# EAGLE design Adafruit LSM9DS0 PCB (EAGLE 6.3)
COMPANY: ADAFRUIT INDUSTRIES; DRAWN: KTOWN; REV: B
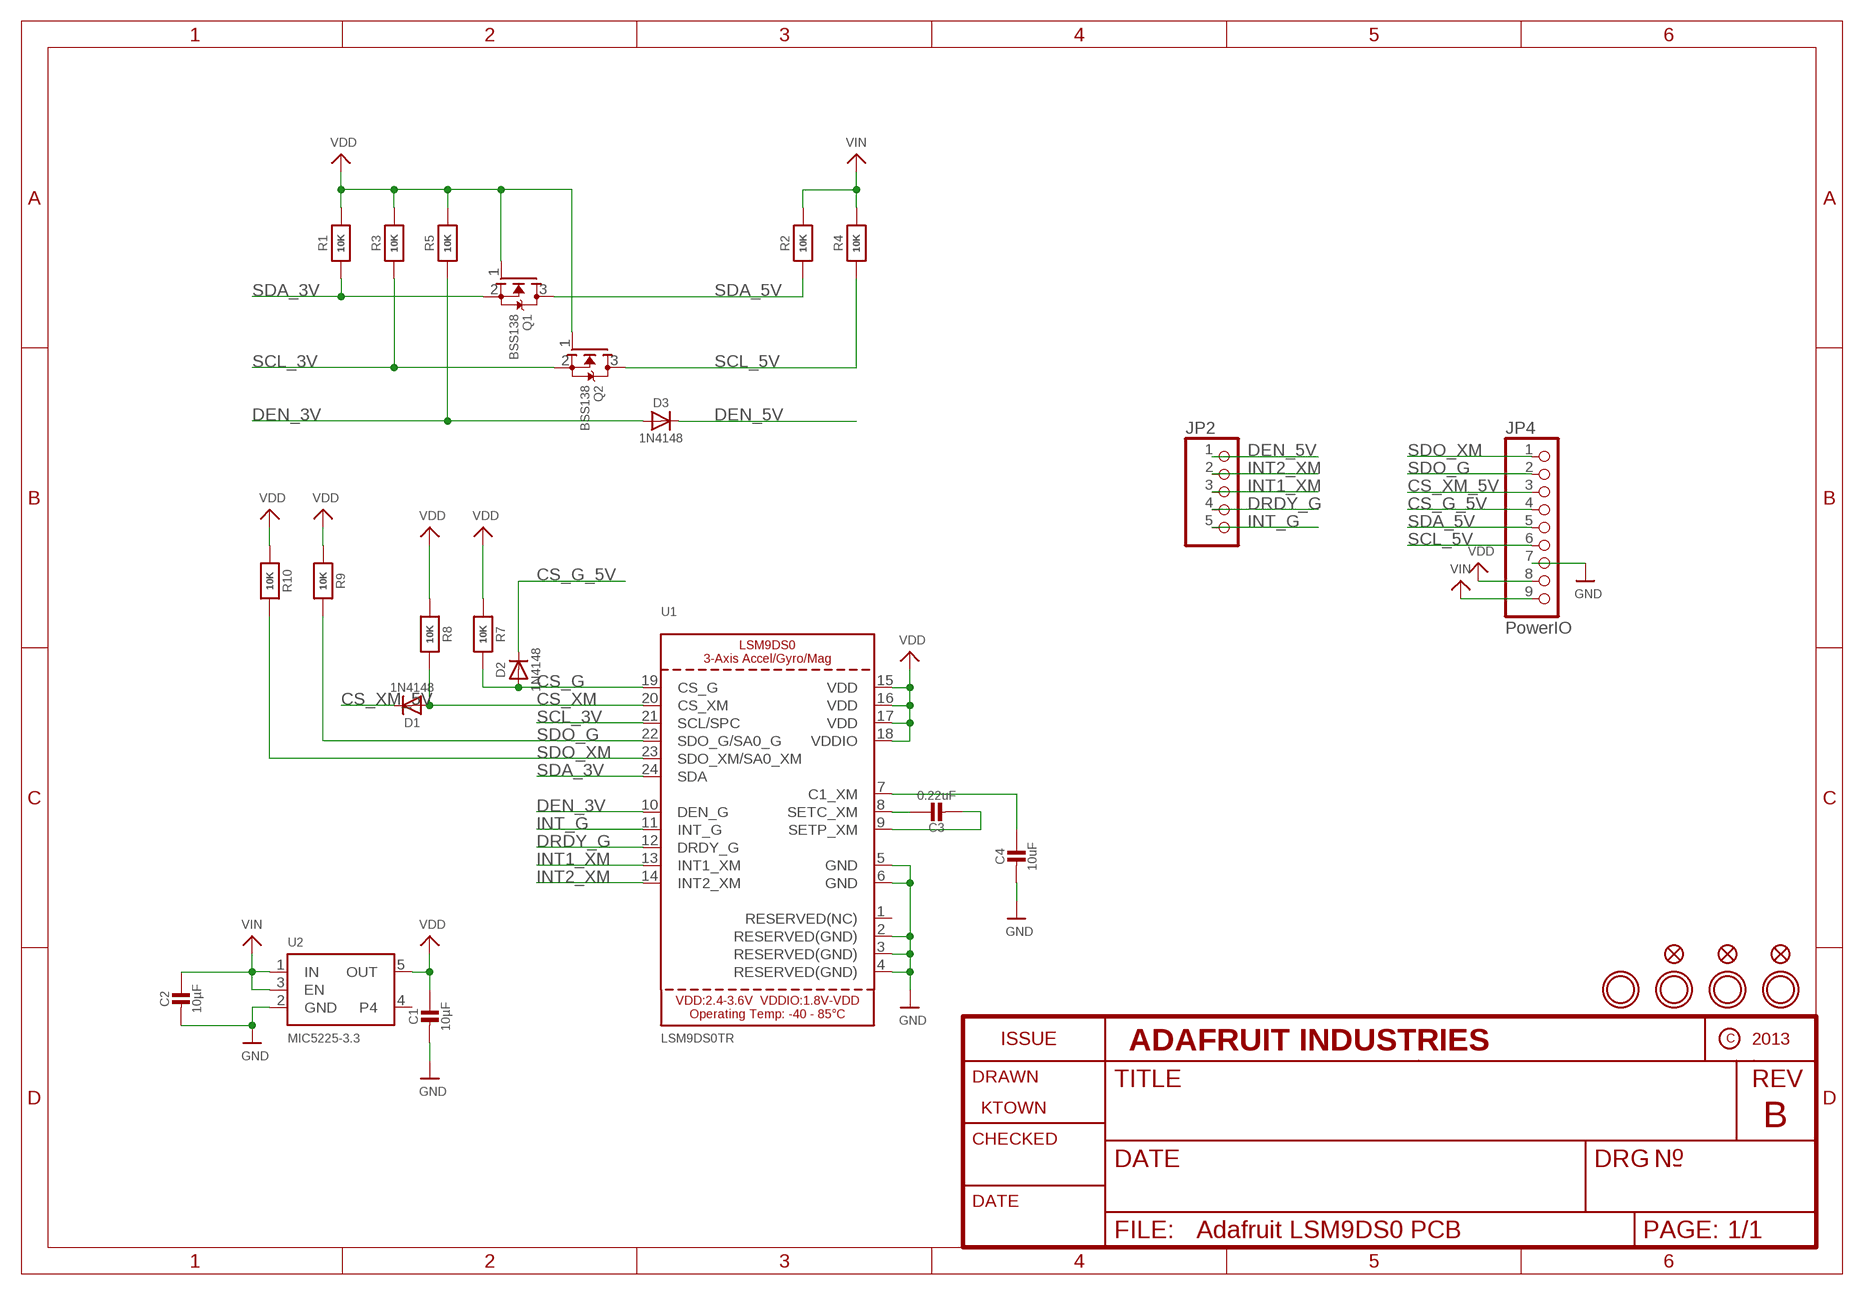
[diagram p0: schematic, sheet 1]

## Parts
C1  10µF  CAP_CERAMIC0805-NOOUTLINE  [0805-NO]
C2  10µF  CAP_CERAMIC0805-NOOUTLINE  [0805-NO]
C3  0.22uF  CAP_CERAMIC0805-NOOUTLINE  [0805-NO]
C4  10uF  CAP_CERAMIC0805-NOOUTLINE  [0805-NO]
D1  1N4148  DIODESOD-323  [SOD-323]
D2  1N4148  DIODESOD-323  [SOD-323]
D3  1N4148  DIODESOD-323  [SOD-323]
FID1  FIDUCIAL""  [FIDUCIAL_1MM]
FID2  FIDUCIAL""  [FIDUCIAL_1MM]
FID3  FIDUCIAL""  [FIDUCIAL_1MM]
JP2  HEADER-1X570MIL  [1X05_ROUND_70]
JP4  PowerIO  HEADER-1X970MIL  [1X09_ROUND_70]
Q1  BSS138  MOSFET-NWIDE  [SOT23-WIDE]
Q2  BSS138  MOSFET-NWIDE  [SOT23-WIDE]
R1  10K  RESISTOR0805_NOOUTLINE  [0805-NO]
R2  10K  RESISTOR0805_NOOUTLINE  [0805-NO]
R3  10K  RESISTOR0805_NOOUTLINE  [0805-NO]
R4  10K  RESISTOR_0805MP  [_0805MP]
R5  10K  RESISTOR0805_NOOUTLINE  [0805-NO]
R7  10K  RESISTOR0805_NOOUTLINE  [0805-NO]
R8  10K  RESISTOR0805_NOOUTLINE  [0805-NO]
R9  10K  RESISTOR0805_NOOUTLINE  [0805-NO]
R10  10K  RESISTOR0805_NOOUTLINE  [0805-NO]
U1  LSM9DS0TR  LSM9DS0  [LGA24_4X4MM]
U2  MIC5225-3.3  VREG_SOT23-5  [SOT23-5]
U$4  MOUNTINGHOLE2.5  [MOUNTINGHOLE_2.5_PLATED]
U$5  MOUNTINGHOLE2.5  [MOUNTINGHOLE_2.5_PLATED]
U$6  MOUNTINGHOLE2.5  [MOUNTINGHOLE_2.5_PLATED]
U$7  MOUNTINGHOLE2.5  [MOUNTINGHOLE_2.5_PLATED]

## Nets
CS_G: D2.A R7.2 U1.19(CS_G)
CS_G_5V: D2.C JP4.4
CS_XM: D1.A R8.2 U1.20(CS_XM)
CS_XM_5V: D1.C JP4.3
DEN_3V: D3.A R5.1 U1.10(DEN_G)
DEN_5V: D3.C JP2.1
DRDY_G: JP2.4 U1.12(DRDY_G)
GND: C1.2 C2.2 C4.2 JP4.7 U1.2(RESERVED(GND)) U1.3(RESERVED(GND)) U1.4(RESERVED(GND)) U1.5(GND) U1.6(GND) U2.2(GND)
INT1_XM: JP2.3 U1.13(INT1_XM)
INT2_XM: JP2.2 U1.14(INT2_XM)
INT_G: JP2.5 U1.11(INT_G)
N$1: C3.1 U1.8(SETC_XM)
N$2: C3.2 U1.9(SETP_XM)
N$3: C4.1 U1.7(C1_XM)
SCL_3V: Q2.2(S) R3.1 U1.21(SCL/SPC)
SCL_5V: JP4.6 Q2.3(D) R4.1
SDA_3V: Q1.2(S) R1.1 U1.24(SDA)
SDA_5V: JP4.5 Q1.3(D) R2.1
SDO_G: JP4.2 R9.2 U1.22(SDO_G/SA0_G)
SDO_XM: JP4.1 R10.2 U1.23(SDO_XM/SA0_XM)
VDD: C1.1 JP4.8 Q1.1(G) Q2.1(G) R1.2 R3.2 R5.2 R7.1 R8.1 R9.1 R10.1 U1.15(VDD) U1.16(VDD) U1.17(VDD) U1.18(VDDIO) U2.5(OUT)
VIN: C2.1 JP4.9 R2.2 R4.2 U2.1(IN) U2.3(EN)
Unconnected: U1.1(RESERVED(NC)) U2.4

## Library data of the parts
C1-C4 = microbuilder:CAP_CERAMIC: Ceramic Capacitors For new designs, use the packages preceded by an '_' character since they are more reliable: The following footprints should be used on most boards: _0402 - Standard footprint for regular board layouts _0603 - Standard footprint for regular board layouts _0805 - Standard footprint for regular board layouts _1206 - Standard footprint for regular board layouts For extremely tight-pitch boards where space is at a premium, the following 'micro-pitch' footprints can be used (smaller pads, no silkscreen outline, etc.): _0402MP - Micro-pitch footprint for very dense/compact boards _0603MP - Micro-pitch footprint for very dense/compact boards _0805MP - Micro-pitch footprint for very dense/compact boards _1206MP - Micro-pitch footprint for very dense/compact boards
D1-D3 = microbuilder:DIODE: Diode SMA Model Volts Amps Type Vf Ir Digikey # Notes SSA34-E3 40V 3A Schottky 480mV @ 3A 200uA @ 40V SSA34-E3/61TGITR-ND CDBA120-G 20V 1A Schottky 500mV @ 1A 500uA @ 20V 641-1014-6-ND REEL MBRA210 10V 2A Schottky 350mV @ 2A 700uA @ 10V MBRA210LT3 SOD-123 Model Volts Amps Type Vf Ir Order # Notes BAT54T1G 30V 200mA Schottky 800mV @ 200mA 2uA @ 25V BAT54T1GOSTR-ND B0530W 30V 500mA Schottky 430mV @ 500mA 130uA @ 30V B0530W-FDICT-ND REEL MBR120 20V 1A Schottky 340mV @ 1A MBR120VLSFT1GOSCT-ND SOD-323 Model Volts Amps Type Vf Ir Order # Notes PMEG2005EJ 20V 500mA Schottky 355mV @ 500mA 568-4110-1-ND ZLLS410 10V 570mA Schottky 380mV @ 570mA ZLLS410CT-ND 1N4148WS 75V 150mA Silicon/Simple 1V 1N4148WSFSCT-ND REEL SOD-523 Model Volts Amps Type Vf Ir Order # Notes BAT54XV2 30V 200mA Schottky 0.8V @ 100mA BAT54XV2CT-ND TB751S 30V 30mA Schottky RB751S-40TE61CT-ND SOT23-R/W (R = Solder Paste/Reflow Ovens, W = Hand-Soldering) Model Volts Amps Type Vf Ir Order # Notes BAT54FILM 40V 300mA Schottky 497-7162-1-ND POWERDI-5 Model Volts Amps Type Vf Ir Order # Notes PDS560 60V 5A Schottky 670mV @ 5A 150uA @ 60V PDS560DICT-ND
FID1-FID3 = microbuilder:FIDUCIAL: Fiducial Alignment Points Various fiducial points for machine vision alignment.; BOM: EXCLUDE
JP2 = microbuilder:HEADER-1X5: PIN HEADER
JP4 = microbuilder:HEADER-1X9: PIN HEADER
Q1 Q2 = microbuilder:MOSFET-N: N-Channel Mosfet LEGEND VDS: Voltage Drain-Source ID: Drain Current RDS(ON): Drain-Source On-State Resistance VGS(TH): Gate-Source Threshold Voltage CISS: Drain-Source Input Capacitance SOT-23 Name VDS ID RDS(ON) VGS(TH) CISS Order Number 2N7002E 60V 260mA 2.5 Ohm 2.5V @ 250uA 26.7pF @ 25V 2N7002ET1GOSTR-ND BSH103 30V 850mA 400 mOhm 400mV @ 1mA 83pF @ 24V BSH103,235-ND BSS138 60V 320mA 1.6 Ohm 1.5V @ 250uA 50pF @ 10V Mouser: 771-BSS138PW115 DMN2075U-7 20V 4.2A 38 mOhm 1V @ 250 uA 594.3pF @ 10V DMN2075U-7DICT-ND * BSS138 good choice for I2C level-shifting POWERPAK 1212-8 Name VDS ID RDS(ON) VGS(TH) CISS Order Number Si7308DN 60V 6A 58 mOhm 3V @ 250uA 665pF @ 15V SI7308DN-T1-E3CT-ND
R1-R5 R7-R10 = microbuilder:RESISTOR: Resistors For new designs, use the packages preceded by an '_' character since they are more reliable: The following footprints should be used on most boards: _0402 - Standard footprint for regular board layouts _0603 - Standard footprint for regular board layouts _0805 - Standard footprint for regular board layouts _1206 - Standard footprint for regular board layouts For extremely tight-pitch boards where space is at a premium, the following 'micro-pitch' footprints can be used (smaller pads, no silkscreen outline, etc.): _0402MP - Micro-pitch footprint for very dense/compact boards _0603MP - Micro-pitch footprint for very dense/compact boards _0805MP - Micro-pitch footprint for very dense/compact boards _1206MP - Micro-pitch footprint for very dense/compact boards
U1 = microbuilder:LSM9DS0: LSM9DS0 3-Axis Accelerometer/Gyroscope/Magnetometer ±2/±4/±6/±8/±16 g linear acceleration ±2/±4/±8/±12 gauss magnetic ±245/±500/±2000 dps angular rate I2C/SPI Interface 2.4-3.6V Supply, 1.8V - VDD Logic
U2 = microbuilder:VREG_SOT23-5: SOT23-5 Fixed Voltage Regulators Part Current Out V Out V In V Dropout θJA (°C/W) TJ (°C) Digikey Part No. ADP121 150mA 3.3V 3.4-5.5V 0.09V @ 150mA -- -- ADP121-AUJZ33R7CT-ND ADP121 150mA 3.0V 3.1-5.5V 0.09V @ 150mA -- -- ADP121-AUJZ30R7CT-ND ADP122 300mA 3.3V 3.4-5.5V 0.085V @ 300mA -- -- ADP122AUJZ-3.3-R7CT-ND ADP1712 300mA 3.3V 3.5-5.5V 0.17V @ 300mA -- -- ADP1712AUJZ-3.3-R7TR-ND AP7311 (Low Cost) 150mA 3.3V 3.5-6V 0.15V @ 150mA -- -- AP7311-33WG-7DICT-ND LD39015M18R 150mA 1.8V 1.9V-5.5V 0.08V @ 100mA -- -- 497-6977-1-ND LP2985A-33DBVR 150mA 3.3V 3.3-16V 0.28V @ 150mA 206 150 296-18479-1-ND MCP1824T-3302E/OT 300mA 3.3V 3.5V-6V 0.2V @ 300mA -- -- MCP1824T-3302E/OTCT-ND MIC5205-2.5YM5 TR 150mA 2.5V 2.7-16V 0.165V @ 150mA -- -- 576-1257-2-ND MIC5205-3.0YM5 TR 150mA 3.0V 3.2V-16V 0.165V @ 150mA -- -- 576-1258-2-ND MIC5205-3.3YM5 TR 150mA 3.3V 3.5V-16V 0.165V @ 150mA -- -- 576-1259-2-ND TPS780330220 150mA 3.3V+2.2V 3.6-5.5V 250mV Max -- -- 296-23332-1-ND TDA3663/N1,135 100mA 3.3V 3.5-45V 0.18V @ 50mA -- -- 568-5343-1-ND Max operating temp can be calculated using θJA, TJ (max junction temperature), and power in watts. Set the "Maximum Ambient Temperature" until it reaches TJ ("Max Junction Temperature"), which is the absolute limit for safe use of the regulator: Heat Sink Temperature Calculator <http://www.daycounter.com/Calculators/Heat-Sink-Temperature-Calculator.phtml> For example, With 12V source into a 3.3V LP2985 and a 30mA load, we are dissipating (12V-3.3V) * 0.03A = 0.261W. With a θJA of 206 °C/W, a TJ of 150°C, and 261mW we can safely use the chip without a heat sink up to 75°C (=147.1°C Junction Temperature).
U$4-U$7 = microbuilder:MOUNTINGHOLE: Mounting Hole For #2 screws (0.086"/2.18mm width, 0.094"/2.4mm hole) use 2.5mm; BOM: EXCLUDE

## Board
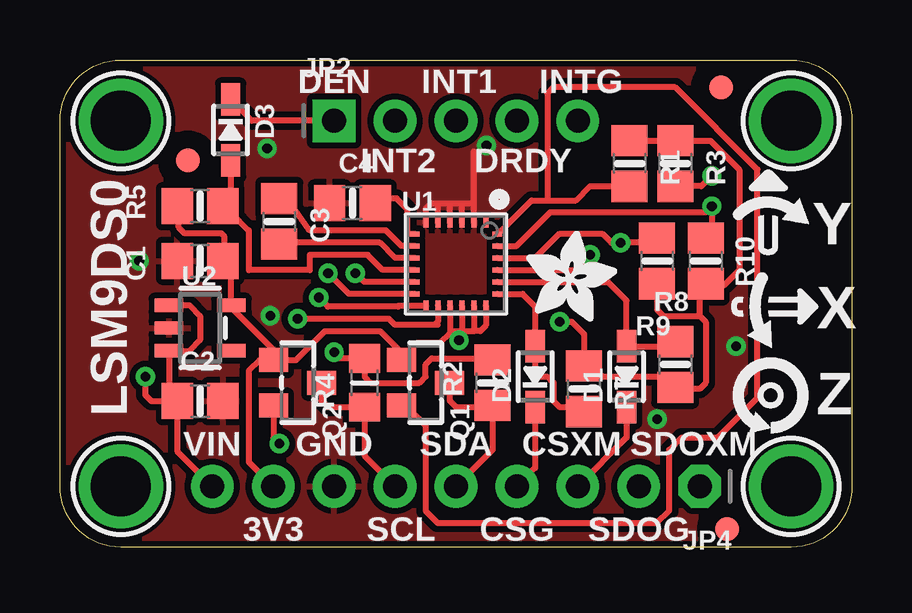
[diagram p1: board, top side]
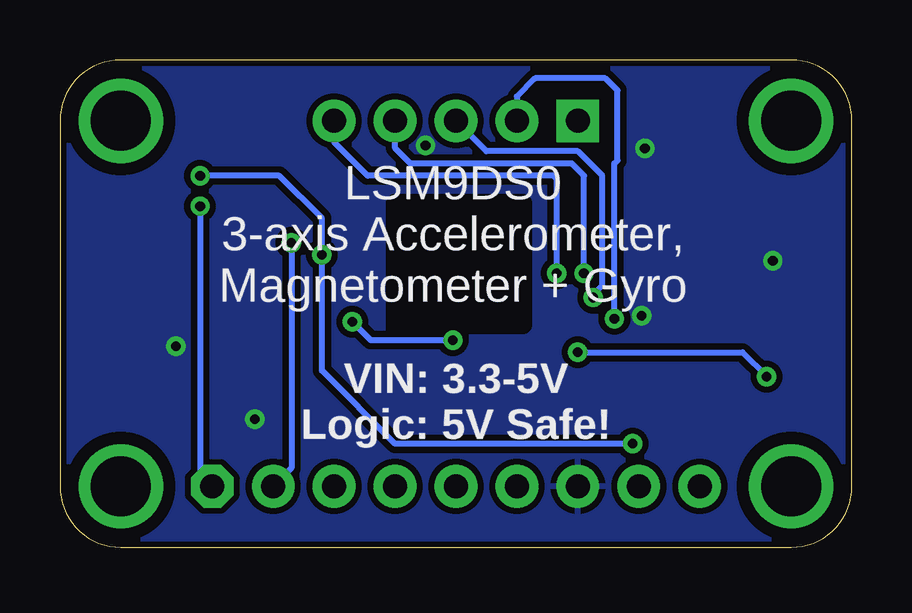
[diagram p2: board, bottom side, seen from below]

Size 33.02 x 20.32 mm. Coordinates in mm from the lower left corner, seen from the top.
Outline: 0,2.54 0,17.78 arc-90 2.54,20.32 30.48,20.32 arc-90 33.02,17.78 33.02,2.54 arc-90 30.48,0 2.54,0 arc-90 0,2.54
Copper layers (1*16): Top 0.035mm / dielectric 1.5mm / Bottom 0.035mm
Design rules "adafruit *": minimum track width 8mil, minimum drill 15.5mil, track to track 8mil, track to pad 8mil, pad to pad 8mil, via to via 8mil, smd to smd 8mil, copper to edge 10mil, drill to drill 8mil, minimum pad ring 10mil, minimum via ring 8mil, stop-mask expansion 2mil, vias tented up to drill 20mil, thermal gap 10mil
tRestrict: area 15.4,13.5 to 15.5,13.8; area 15.9,13.5 to 16,13.8; area 16.4,13.5 to 16.5,13.8; area 16.9,13.5 to 17,13.8
bRestrict: area 13.7,9.3 to 19.1,14.4

### Footprints (pad centres in the part's own frame; a part is rotated, then mirrored left to right if it is on the bottom)
0805-NO = smd 1.3 x 1.5: 1 -0.95,0; 2 0.95,0
SOD-323 = smd 1.35 x 0.8: A 1.27,0; C -1.27,0
FIDUCIAL_1MM = smd 1 x 1: 1 0,0
1X05_ROUND_70 = drill 1 pad 1.778 square: 1 -5.08,0 | drill 1 pad 1.778: 2 -2.54,0; 3 0,0; 4 2.54,0; 5 5.08,0
1X09_ROUND_70 = drill 1 pad 1.778 octagon: 1 -10.16,0 | drill 1 pad 1.778: 2 -7.62,0; 3 -5.08,0; 4 -2.54,0; 5 0,0; 6 2.54,0; 7 5.08,0; 8 7.62,0; 9 10.16,0
SOT23-WIDE = smd 1 x 1.2: 1 -0.95,-1; 2 0.95,-1; 3 0,1
_0805MP = smd 1.2 x 1.3: 1 -1.016,0; 2 1.016,0
LGA24_4X4MM = smd 0.21 x 0.4: 1 -1.25,-1.725; 2 -0.75,-1.725; 3 -0.25,-1.725; 4 0.25,-1.725; 5 0.75,-1.725; 6 1.25,-1.725; 13 1.25,1.725; 14 0.75,1.725; 15 0.25,1.725; 16 -0.25,1.725; 17 -0.75,1.725; 18 -1.25,1.725 | smd 0.4 x 0.21: 7 1.725,-1.25; 8 1.725,-0.75; 9 1.725,-0.25; 10 1.725,0.25; 11 1.725,0.75; 12 1.725,1.25; 19 -1.725,1.25; 20 -1.725,0.75; 21 -1.725,0.25; 22 -1.725,-0.25; 23 -1.725,-0.75; 24 -1.725,-1.25
SOT23-5 = smd 0.55 x 1.2: 1 -0.95,-1.3; 2 0,-1.3; 3 0.95,-1.3; 4 0.95,1.3; 5 -0.95,1.3
MOUNTINGHOLE_2.5_PLATED = drill 2.5 pad 3.2: P$1 0,0

### Placement (x,y rotation side)
C1  5.84,11.94 180 top
C2  5.84,6.1 0 top
C3  9.14,13.59 270 top
C4  12.19,14.35 180 top
D1  23.62,7.11 90 top
D2  19.81,7.11 90 top
D3  7.11,17.4 270 top
FID1  5.33,16.13 0 top
FID2  27.81,0.76 0 top
FID3  27.56,19.18 0 top
JP2  16.51,17.78 0 top
JP4  16.51,2.54 180 top
Q1  15.24,6.86 270 top
Q2  9.91,6.86 270 top
R1  23.75,16 90 top
R2  18.03,6.86 90 top
R3  25.65,16 90 top
R4  12.7,6.86 90 top
R5  5.84,14.22 180 top
R7  21.84,6.6 270 top
R8  25.65,7.62 90 top
R9  24.89,11.94 90 top
R10  26.92,11.94 90 top
U1  16.51,11.81 180 top
U2  5.84,9.14 270 top
U$4  2.54,2.54 0 top
U$5  30.48,2.54 0 top
U$6  30.48,17.78 0 top
U$7  2.54,17.78 0 top
U$14  [SYMBOL_GYROXYZ_YREV_10MM]  27.94,14.99 270 top
U$23  [ADAFRUIT_3.5MM]  19.43,9.4 0 top

### Tracks (layer width: path | path; a pad name or v marks a point on that pad's centre or on a via)
CS_G
  Top 0.254: U1.19 19.28,10.56 19.81,10.03 D2.A 19.81,7.37 20.07,7.11 20.32,7.11 20.57,6.86 20.57,6.1 20.83,5.84 21.66,5.84 R7.2
CS_G_5V
  Top 0.254: D2.C 19.81,3.3 JP4.4
CS_XM
  Top 0.254: R8.2 25.47,8.38 D1.A 23.62,10.29 22.85,11.06 U1.20
CS_XM_5V
  Top 0.254: D1.C 23.62,4.57 JP4.3
DEN_3V
  Top 0.254: U1.10 13.46,11.56 12.83,12.19 10.41,12.19 10.41,11.56 7.87,11.56 7.87,13.21 7.11,13.97 7.05,13.97 R5.1 7.11,14.54 D3.A
DEN_5V
  Top 0.254: JP2.1 8,17.78 D3.C
DRDY_G  (via drill 0.4)
  Top 0.254: U1.12 12.04,10.56 v11.18,11.43
  Bottom 0.254: v11.18,11.43 11.18,15.49 11.68,16 18.41,16 19.05,16.64 JP2.4
GND  (via drill 0.4)
  Top 0.254: U1.2 17.26,14.35 | 17.26,14.35 17.26,16.5 | U1.6 15.26,14.12 15.49,14.35 15.75,14.35 | 15.75,14.35 16.26,14.35 | 16.26,14.35 16.76,14.35 | 16.76,14.35 17.26,14.35 | U1.5 15.76,14.34 15.75,14.35 | U1.4 16.26,14.35 | U1.3 16.76,14.35
  other vias: 17.78,16.76 8.76,9.65 24.89,5.33 3.3,11.94 28.19,8.38 8.64,16.64
  pour Bottom (isolate 0.254): 0,2.54 0,17.78 arc-90 2.54,20.32 30.48,20.32 arc-90 33.02,17.78 33.02,2.54 arc-90 30.48,0 2.54,0 arc-90
  pour Top (isolate 0.254): 0,2.54 0,17.78 arc-90 2.54,20.32 30.48,20.32 arc-90 33.02,17.78 33.02,2.54 arc-90 30.48,0 2.54,0 arc-90
INT1_XM  (via drill 0.4)
  Top 0.254: U1.13 15.26,10.05 14.08,10.05 14.1,10.03 11.18,10.03 v10.79,10.41
  Bottom 0.254: v10.79,10.41 10.92,10.41 10.41,10.92 10.41,15.49 11.43,16.51 15.24,16.51 JP2.3
INT2_XM  (via drill 0.4)
  Top 0.254: 15.75,9.27 15.62,9.27 | 15.62,9.27 13.97,9.27 13.72,9.53 v9.91,9.53 | U1.14 15.76,9.41 15.62,9.27
  Bottom 0.254: v9.91,9.53 9.91,16 9.78,16.13 9.78,19.05 10.29,19.56 13.21,19.56 13.97,18.8 JP2.2
INT_G  (via drill 0.4)
  Top 0.254: U1.11 12.69,11.06 v12.32,11.43
  Bottom 0.254: JP2.5 21.59,16.89 20.19,15.49 12.45,15.49 12.32,15.37 v12.32,11.43
N$1
  Top 0.254: U1.8 14.24,12.56 13.59,13.21 10.41,13.21 9.78,14.1 9.59,14.1 C3.1
N$2
  Top 0.254: U1.9 13.97,12.06 13.34,12.7 9.65,12.7 9.53,12.83 | 9.53,12.83 9.27,13.08 | C3.2 9.34,12.64 9.53,12.83
N$3
  Top 0.254: U1.7 14.5,13.06 14.5,14.08 14.04,14.54 13.33,14.54 C4.1 13.14,14.53
SCL_3V  (via drill 0.4)
  Top 0.254: U1.21 21.46,11.56 v22.09,12.19 v22.1,12.19 | Q2.2 8.91,4.56 v9.14,4.32 | v27.18,15.49 26.74,15.05 R3.1
  Bottom 0.254: v9.14,4.32 19.05,4.32 22.1,7.37 v22.1,12.19 22.1,13.72 23.88,15.49 v27.18,15.49
SCL_5V
  Top 0.254: Q2.3 10.91,6.11 11.18,5.84 R4.1 12.7,3.81 JP4.6
SDA_3V
  Top 0.254: 20.32,14.46 19.66,14.46 18.27,13.06 U1.24 | 20.32,14.46 21.5,14.46 22.1,15.05 R1.1 | Q1.2 14.41,5.91 15.24,5.08 15.24,1.52 15.75,1.02 24.89,1.02 25.4,1.52 25.4,4.06 25.91,4.57 27.43,4.57 29.08,6.22 29.08,15.75 25.65,19.18 20.57,19.18 20.32,18.92 20.32,14.46
SDA_5V
  Top 0.254: Q1.3 16.24,6.11 16.51,5.84 17.97,5.84 R2.1 18.03,4.06 JP4.5
SDO_G  (via drill 0.4)
  Top 0.254: R9.2 24.7,12.7 v23.37,12.7 22.99,12.7 22.61,13.08 20.82,13.08 19.81,12.06 U1.22
  Bottom 0.254: v23.37,12.7 23.37,3.3 JP4.2
SDO_XM  (via drill 0.4)
  Top 0.254: U1.23 19.04,12.56 20.45,13.97 26.92,13.97 v27.18,14.22 27.18,13.97 | 27.18,13.97 27.18,13.14 R10.2 | 27.17,13.96 27.18,13.97
  Bottom 0.254: v27.18,14.22 27.18,3.05 JP4.1
VDD  (via drill 0.4)
  Top 0.254: Q2.1 8.32,7.81 7.87,7.37 7.87,3.56 JP4.8 | Q2.1 8.89,7.82 8.89,8.26 7.14,10 U2.5 7.14,11.59 C1.1 6.86,12 6.86,12.95 6.73,13.08 5.21,13.08 4.95,13.34 4.95,14.16 R5.2 | Q2.1 9.84,7.81 11.05,9.02 13.34,9.02 14.24,8.11 Q1.1 | 14.22,7.82 Q1.1 | 14.31,7.87 Q1.1 | R1.2 R3.2 27.12,16.95 28.32,15.75 28.32,11.56 27.69,10.92 26.99,10.92 R10.1 26.67,10.73 26.67,9.65 | U1.15 16.26,8.94 | U1.18 17.76,9.25 17.53,9.02 17.27,9.02 | U1.17 17.26,9.03 17.27,9.02 | v20.83,9.4 21.34,9.4 21.84,8.89 R7.1 22.16,7.55 22.61,7.11 25.21,7.11 R8.1 25.72,6.6 26.67,6.6 26.92,6.86 26.92,9.4 26.67,9.65 | R9.1 24.89,9.91 25.15,9.65 26.67,9.65 | 16.26,8.94 16.56,8.64 v16.64,8.64 16.76,8.64 U1.16 | 16.26,8.94 16.34,9.02 17.27,9.02 | 16.26,8.94 15.83,8.51 14.86,8.51 14.24,7.89 Q1.1
  Bottom 0.254: v20.83,9.4 20.07,8.64 v16.64,8.64
VIN  (via drill 0.4)
  Top 0.254: U2.1 5.4,10.09 5.84,9.65 5.84,8.64 5.4,8.19 U2.3 4.54,6.45 C2.1 | C2.1 4.89,4 JP4.9 | v11.43,8.13 11.68,7.87 R4.2 12.7,7.11 12.95,6.86 14.99,6.86 15.24,7.11 15.24,7.62 15.49,7.87 17.97,7.87 R2.2 | v3.56,7.11 3.56,6.35 3.81,6.1 C2.1
  Bottom 0.254: v11.43,8.13 4.57,8.13 v3.56,7.11

### Text on the board
tPlace: DEN | INT1 | INTG | INT2 | DRDY | Y | LSM9DS0 | X | Z | VIN | GND | SDA | CSXM | SDOXM | 3V3 | SCL | CSG | SDOG
bPlace: LSM9DS0 / 3-axis Accelerometer, / Magnetometer + Gyro | VIN: 3.3-5V / Logic: 5V Safe!